# EAGLE design ai_charger_lipo (EAGLE 7.1.0)
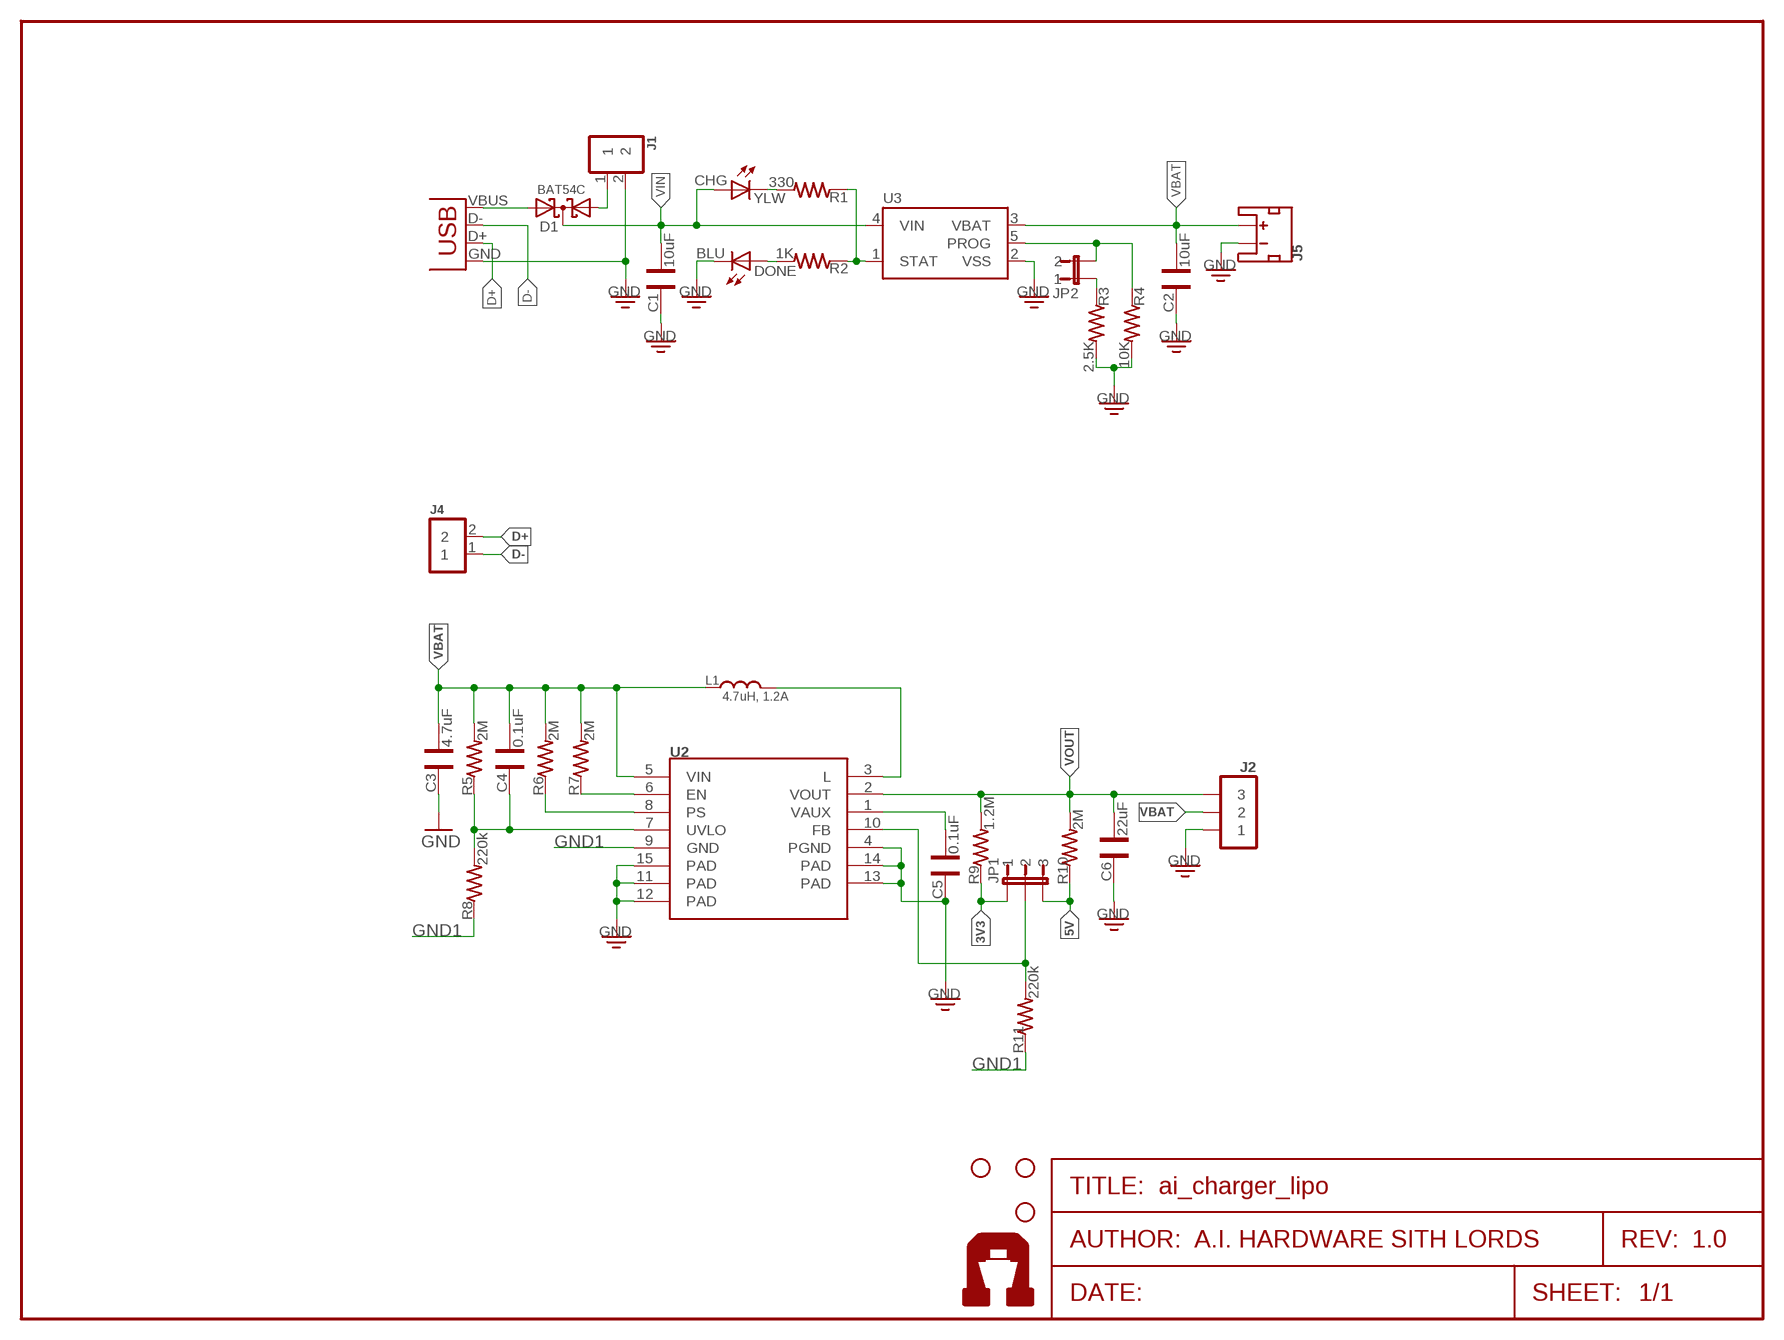
[diagram p0: schematic, sheet 1]
FRAME1 (FRAME-LETTER): AUTHOR: A.I. HARDWARE SITH LORDS; REV: 1.0

## Parts
C1  10uF  CAP0603  [CAP-0603]
C2  10uF  CAP0603  [CAP-0603]
C3  4.7uF  CAP0603  [CAP-0603]
C4  0.1uF  CAP0603  [CAP-0603]
C5  0.1uF  CAP0603  [CAP-0603]
C6  22uF  CAP0603  [CAP-0603]
CHG  YLW  LED0603  [LED-0603]
D1  BAT54C  [SOT-23]
DONE  BLU  LED0603  [LED-0603]
J1  1X02ST  [1X02-ST]
J2  1X03NOFIRST  [1X03-NOFIRST]
J4  1X02NOFIRST  [1X02-NOFIRST]
J5  JST-2-MALE  [JST-2-SMD]
JP1  1X03-PJNOFIRST  [1X03-NOFIRST]
JP2  1X02-PJNOFIRST  [1X02-NOFIRST]
L1  4.7uH, 1.2A  IND0603  [IND-0603]
R1  330  RES0603  [RES-0603]
R2  1K  RES0603  [RES-0603]
R3  2.5K  RES0603  [RES-0603]
R4  10K  RES0603  [RES-0603]
R5  2M  RES0603  [RES-0603]
R6  2M  RES0603  [RES-0603]
R7  2M  RES0603  [RES-0603]
R8  220k  RES0603  [RES-0603]
R9  1.2M  RES0603  [RES-0603]
R10  2M  RES0603  [RES-0603]
R11  220k  RES0603  [RES-0603]
STANDOFF1  STAND-OFF  [STAND-OFF]
STANDOFF2  STAND-OFF  [STAND-OFF]
STANDOFF3  STAND-OFF  [STAND-OFF]
U2  TPS61200  [QFN-10-PAD]
U3  MCP73831  [SOT23-5]
U$1  AI-LOGOXS  [AI-LOGO-XS]
U$2  AI-LOGOXS  [AI-LOGO-XS]
X2  USBMICROB-TH  [USB-MICROB-TH]

## Nets
3V3: JP1.1 R9.1
5V: JP1.3 R10.1
D+: J4.2 X2.D+
D-: J4.1 X2.D-
EN: R7.1 U2.6(EN)
FB: JP1.2 R11.2 U2.10(FB)
GND: C1.2 C2.2 C3.2 C5.2 C6.2 DONE.C J1.2 J2.1 J5.2(-) R3.2 R4.2 U2.4(PGND) U2.11(PAD) U2.12(PAD) U2.13(PAD) U2.14(PAD) U2.15(PAD) U3.2(VSS) X2.GND
GND1: R8.1 R11.1 U2.9(GND)
N$1: C5.1 U2.1(VAUX)
N$2: L1.1 U2.3(L)
N$3: JP2.2 R4.1 U3.5(PROG)
N$4: R1.1 R2.1 U3.1(STAT)
N$5: CHG.C R1.2
N$6: D1.1(A1) J1.1
N$7: D1.2(A2) X2.VBUS
N$9: DONE.A R2.2
N$10: JP2.1 R3.1
PS: R6.1 U2.8(PS)
UVLO: C4.2 R5.1 R8.2 U2.7(UVLO)
VBAT: C2.1 C3.1 C4.1 J2.2 J5.1(+) L1.2 R5.2 R6.2 R7.2 U2.5(VIN) U3.3(VBAT)
VIN: C1.1 CHG.A D1.3(CC) U3.4(VIN)
VOUT: C6.1 J2.3 R9.2 R10.2 U2.2(VOUT)

## Library data of the parts
C1-C6 = Ai_Passives:CAP
CHG DONE = Ai_LED:LED
D1 = Ai_DiscreteSemis:BAT54C: Schottky Diodes Source: Fairchild .. BAT54.pdf
J1 J4 = Ai_Connectors:1X02
J2 = Ai_Connectors:1X03
J5 = Ai_Connectors:JST-2-MALE
JP1 = Ai_Connectors:1X03-PJ
JP2 = Ai_Connectors:1X02-PJ
L1 = Ai_Passives:IND
R1-R11 = Ai_Passives:RES: Part # blah Digikey
STANDOFF1-STANDOFF3 = Ai_Electromechanical:STAND-OFF: #4 Stand Off This is the mechanical footprint for a #4 phillips button head screw. Use the keepout ring to avoid running the screw head into surrounding components.
U2 = Ai_Power:TPS61200
U3 = Ai_IC:MCP73831
U$1 U$2 = Ai_Miscellany:AI-LOGO
X2 = Ai_Connectors:USB

## Board
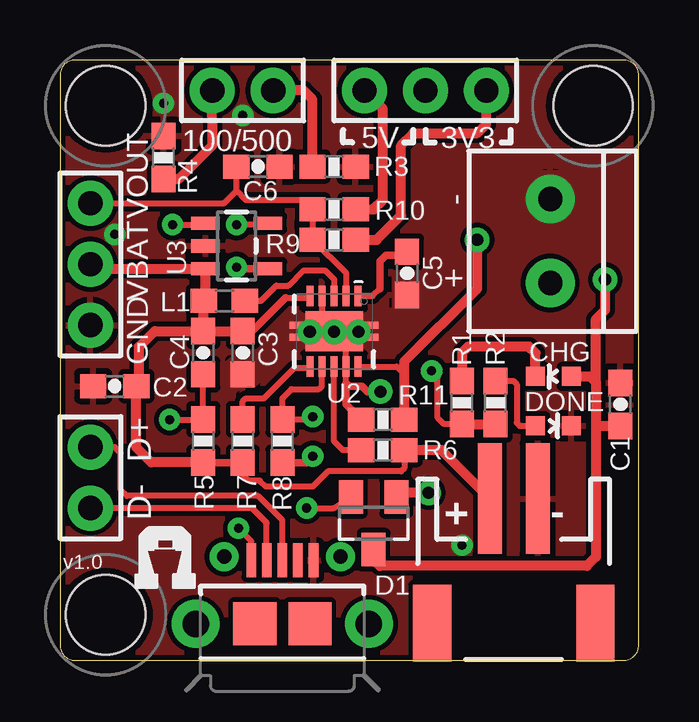
[diagram p1: board, top side]
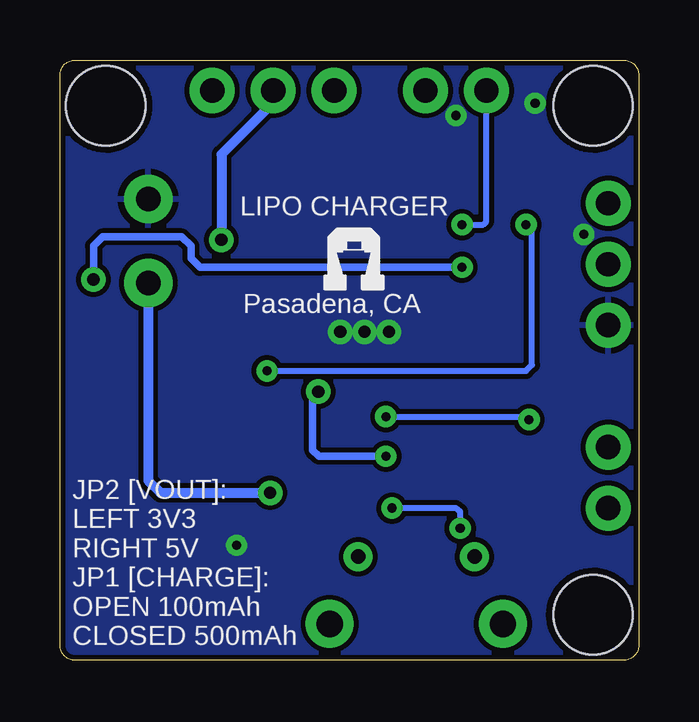
[diagram p2: board, bottom side, seen from below]

Size 24.13 x 25.02 mm. Coordinates in mm from the lower left corner, seen from the top.
Outline: 23.5,25.02 0.64,25.02 arc90 0,24.38 0,0.64 arc90 0.64,0 23.5,0 arc90 24.13,0.64 24.13,24.38 arc90 23.5,25.02
Copper layers (1*16): Top 0.035mm / dielectric 1.5mm / Bottom 0.035mm
Design rules "ai_2layer": minimum track width 7mil, minimum drill 15mil, track to track 8mil, track to pad 8mil, pad to pad 8mil, via to via 8mil, smd to smd 8mil, copper to edge 8mil, drill to drill 8mil, minimum pad ring 12mil, minimum via ring 10mil, stop-mask expansion 4mil, vias tented up to drill 20mil, thermal gap 10mil

### Footprints (pad centres in the part's own frame; a part is rotated, then mirrored left to right if it is on the bottom)
CAP-0603 = smd 1.1 x 1: 1 -0.9,0; 2 0.9,0
LED-0603 = smd 0.8 x 0.8: A 0,-0.75; C 0,0.75
SOT-23 = smd 1 x 1.4: 1 -0.95,-1.1; 2 0.95,-1.1; 3 0,1.1
1X02-ST = drill 1.016 pad 2.032: 1 -1.75,0; 2 1.75,0
1X03-NOFIRST = drill 1.016 pad 1.88: 1 -2.54,0; 2 0,0; 3 2.54,0
1X02-NOFIRST = drill 1.016 pad 1.88: 1 -1.27,0; 2 1.27,0
JST-2-SMD = smd 1 x 4.6: 1 1,-3.7; 2 -1,-3.7 | smd 1.6 x 3.2: NC1 -3.4,1.5; NC2 3.4,1.5
IND-0603 = smd 1.1 x 1: 1 -0.85,0; 2 0.85,0
RES-0603 = smd 1.1 x 1: 1 -0.9,0; 2 0.9,0
STAND-OFF = hole 3.302: 0,0
QFN-10-PAD = smd 0.297 x 0.85: 1 -1,-1.475; 2 -0.5,-1.475; 3 0,-1.475; 4 0.5,-1.475; 5 1,-1.475; 6 1,1.475; 7 0.5,1.475; 8 0,1.475; 9 -0.5,1.475; 10 -1,1.475 | smd 0.7 x 0.28: 11 -1.5,0.25; 12 -1.5,-0.25; 13 1.5,0.25; 14 1.5,-0.25 | smd 2.4 x 1.65: 15 0,0
SOT23-5 = smd 0.55 x 1.2: 1 -0.95,-1.3; 2 0,-1.3; 3 0.95,-1.3; 4 0.95,1.3; 5 -0.95,1.3
USB-MICROB-TH = smd 0.4 x 1.4: D+ 0,2.65; D- -0.65,2.65; GND 1.3,2.65; ID 0.65,2.65; VBUS -1.3,2.65 | smd 1.8 x 1.8: M5 -1.15,0; M6 1.15,0 | drill 0.6 pad 1.2: MT1 -2.425,2.8; MT2 2.425,2.8 | drill 1.1 pad 2: MT3 -3.61,0; MT4 3.61,0

### Placement (x,y rotation side)
C1  23.37,10.67 90 top
C2  2.29,11.43 180 top
C3  7.62,12.83 270 top
C4  5.97,12.83 270 top
C5  14.48,16.13 270 top
C6  8.26,20.57 0 top
CHG  20.57,11.84 90 top
D1  13.08,5.71 180 top
DONE  20.57,9.78 270 top
J1  20.45,17.48 90 top
J2  1.27,16.51 90 top
J4  1.27,7.62 90 top
J5  18.92,3.05 180 top
JP1  15.24,23.75 180 top
JP2  7.62,23.75 180 top
L1  6.86,14.99 180 top
R1  16.76,10.74 90 top
R2  18.16,10.74 90 top
R3  11.43,20.57 0 top
R4  4.32,20.95 90 top
R5  5.97,9.14 270 top
R6  13.46,8.76 0 top
R7  7.62,9.14 270 top
R8  9.27,9.14 90 top
R9  11.43,17.53 180 top
R10  11.43,18.8 180 top
R11  13.46,10.03 0 top
STANDOFF1  1.91,23.11 0 top
STANDOFF2  22.23,23.11 0 top
STANDOFF3  1.91,1.91 0 top
U2  11.43,13.72 180 top
U3  7.37,17.27 270 top
U$1  3.05,2.92 0 top
U$2  13.21,15.37 0 bottom
X2  9.27,1.52 0 top

### Tracks (layer width: path | path; a pad name or v marks a point on that pad's centre or on a via)
3V3
  Top 0.406: R9.1 13.21,17.53 14.22,18.54 14.22,21.46 14.73,21.97 17.4,21.97 17.78,22.35 JP1.1
5V
  Top 0.406: R10.1 13.08,18.8 13.46,19.18 13.46,22.99 JP1.3
D+
  Top 0.254: X2.D+ 9.27,5.84 8.26,6.86 2.79,6.86 2.54,7.11 2.54,8.64 2.29,8.89 J4.2
D-
  Top 0.254: X2.D- 8.62,5.73 8,6.35 J4.1
EN
  Top 0.254: R7.1 7.62,10.79 7.75,10.92 8.51,10.92 9.78,12.19 10.38,12.19 U2.6
FB  (via drill 0.51)
  Top 0.254: U2.10 14.05,12.24 14.35,11.94 | 14.35,10.04 R11.2
  Top 0.406: 14.35,10.04 14.35,11.94 14.35,12.45 17.4,15.49 v17.4,17.53
  Bottom 0.406: JP1.2 15.24,23.24 17.4,21.08 v17.4,17.53
GND  (via drill 0.38, 0.51)
  Top 0.254: U2.4 10.93,14.22
  Top 0.305: 10.93,14.22 U2.15
  other vias: 11.43,13.69 7.62,22.71 4.32,23.22 2.29,17.75 16.76,4.8 10.41,13.69 12.45,13.69
  pour Bottom: 0,25.02 24.13,25.02 24.13,0 0,0
  pour Top (isolate 0.305, no thermals): 15.37,20.32 22.1,20.32 22.1,16.38 18.41,16.38 18.41,18.41 16.76,18.41 16.64,15.62 14.61,13.72 13.84,12.95 9.65,12.95 7.75,11.18 6.6,11.18 6.6,12.06 9.65,14.48 10.77,14.48 10.77,15.8 11.1,15.8 11.1,14.55 13.08,14.55 13.97,14.61 13.97,16.13 15.37,16.21
  pour Top: 0,0 24.13,0 24.13,25.02 0,25.02
GND1  (via drill 0.38, 0.51)
  Top 0.254: 11.93,13.07 U2.9 11.93,11.56
  Top 0.305: R11.1 11.93,10.66 11.93,11.56 12.06,11.43 12.6,11.43 12.83,11.2 v13.36,11.2 | R8.1 10.28,8.24 v10.54,8.51 | 11.93,13.07 11.94,13.08
  Bottom 0.305: v10.54,8.51 13.34,8.51 13.59,8.76 13.59,10.95 v13.36,11.2
N$1
  Top 0.254: U2.1 13.03,15.19 13.34,15.49
  Top 0.305: 13.34,15.49 13.34,16.64 13.59,16.89 14.34,16.89 C5.1
N$2
  Top 0.254: L1.1 8.38,14.99 9.02,15.62 9.53,15.62 10.16,16.26 11.05,16.26 11.43,15.88 U2.3
N$3  (via drill 0.38)
  Top 0.254: U3.5 8.61,18.16 v7.37,18.16
  Top 0.406: JP2.2 6.36,21.47 4.94,20.05 R4.1
  Bottom 0.254: v7.37,18.16 6.48,18.16 6.35,18.29 JP2.2
N$4  (via drill 0.38)
  Top 0.254: R1.1 16.01,9.84 15.75,10.11 15.75,11.81 v15.49,12.06 | v4.7,18.16 6,18.16 U3.1
  Top 0.406: R1.1 R2.1
  Bottom 0.254: v15.49,12.06 4.7,12.06 4.45,12.32 4.45,17.91 v4.7,18.16
N$5
  Top 0.406: CHG.C 19.82,12.81 19.56,13.08 17.02,13.08 16.76,12.83 R1.2
N$6  (via drill 0.51)
  Top 0.406: v15.37,6.99 13.95,6.99 D1.1
  Bottom 0.406: J1.1 20.45,7.49 19.94,6.99 v15.37,6.99
N$7  (via drill 0.38)
  Top 0.254: X2.VBUS 7.97,4.96 v7.44,5.51 | 11.79,6.86 D1.2 11.41,6.35 v10.29,6.35
  Bottom 0.254: v7.44,5.51 7.44,6.2 7.62,6.35 v10.29,6.35
N$9
  Top 0.254: R2.2 18.91,11.64 19.05,11.51 19.05,9.91 19.18,9.78 DONE.A
N$10
  Top 0.406: R3.1 10.53,23.38 10.16,23.75 JP2.1
PS
  Top 0.254: U2.8 11.43,9.13 11.8,8.76 R6.1
UVLO  (via drill 0.38)
  Top 0.254: U2.7 10.92,11.43 10.79,11.3 9.65,11.3 9.27,10.92 R8.2 10.43,10.04 v10.54,10.16 | C4.2 R5.1 5.96,10.03 v4.57,10.03
  Bottom 0.254: v10.54,10.16 4.7,10.16 v4.57,10.03
VBAT
  Top 0.254: R6.2 14.36,8.01 14.22,7.87 11.18,7.87 10.54,7.24 8.59,7.24 8.33,7.49 7.87,7.49 7.62,7.75 R7.2 | C3.1 8.01,13.73 | 9.4,15.11 10.35,15.11 U2.5
  Top 0.305: R5.2 R7.2 | 8.01,13.73 9.4,15.11
  Top 0.406: J2.2 1.46,16.32 U3.3 6.07,15.04 L1.2 5.97,14.9 C4.1 | R5.2 6.08,8.26 3.81,8.26 3.19,8.88 C2.1 3.3,11.55 3.3,13.08 3.95,13.73 C4.1 | C4.1 C3.1 | J5.1 15.91,8.76 R6.2
VIN  (via drill 0.38, 0.51)
  Top 0.305: U3.4 7.43,16.32 v7.37,16.38
  Top 0.406: 21.34,11.7 CHG.A 22.1,11.84 22.35,11.58 | 22.35,11.58 22.35,9.65 | 22.35,9.65 22.35,4.32 21.97,3.94 13.34,3.94 13.08,4.19 D1.3 | C1.1 22.47,9.77 22.35,9.65 | 22.35,11.58 22.35,14.22 22.73,14.61 v22.73,15.88
  Bottom 0.305: v7.37,16.38 18.29,16.38 18.67,16.76 18.67,17.27 19.05,17.65 22.35,17.65 22.73,17.27 v22.73,15.88
VOUT
  Top 0.254: 7.36,19.57 7.75,19.18 10.15,19.18 R10.2 R9.2 10.54,17.53 11.94,16.13 U2.2 | 7.36,19.57 C6.1 | J2.3 6.84,19.05 7.36,19.57

### Text on the board
tPlace: 100/500 | 5V | 3V3 | - | VOUT | + | VBAT | GND | D+ | D- | v1.0
bPlace: LIPO CHARGER | Pasadena, CA | JP2 [VOUT]: / LEFT 3V3 / RIGHT 5V / JP1 [CHARGE]: / OPEN 100mAh / CLOSED 500mAh